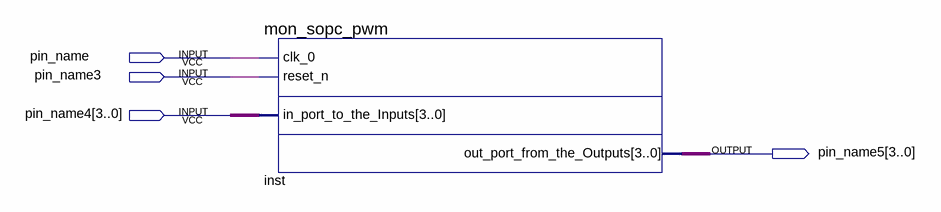
[diagram p0: schematic sheet]
// Quartus schematic sopc_avalon_pwm.bdf as structural Verilog: 1 symbols, 4 pins
module sopc_avalon_pwm (
  input  pin_name,
  input  pin_name3,
  input  [3:0] pin_name4,
  output [3:0] pin_name5
);

  mon_sopc_pwm inst (
    .clk_0(pin_name), .reset_n(pin_name3), .in_port_to_the_Inputs(pin_name4),
    .out_port_from_the_Outputs(pin_name5));
endmodule
